# EAGLE design 4pwm (EAGLE 7.5.0)
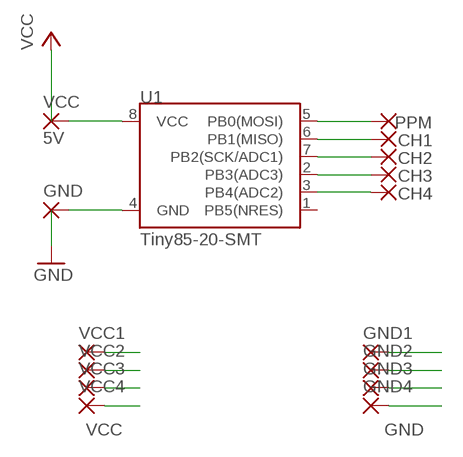
[diagram p0: schematic, sheet 1]

## Parts
CH1  SMD2  [SMD1,27-2,54]
CH2  SMD2  [SMD1,27-2,54]
CH3  SMD2  [SMD1,27-2,54]
CH4  SMD2  [SMD1,27-2,54]
GND  SMD2  [SMD1,27-2,54]
GND1  SMD2  [SMD1,27-2,54]
GND2  SMD2  [SMD1,27-2,54]
GND3  SMD2  [SMD1,27-2,54]
GND4  SMD2  [SMD1,27-2,54]
PPM  SMD2  [SMD1,27-2,54]
U1  Tiny85-20-SMT  ATTINY45TINY85-20-SMT  [SO08-EIAJ]
VCC  5V  SMD2  [SMD1,27-2,54]
VCC1  SMD2  [SMD1,27-2,54]
VCC2  SMD2  [SMD1,27-2,54]
VCC3  SMD2  [SMD1,27-2,54]
VCC4  SMD2  [SMD1,27-2,54]

## Nets
GND: GND1.1(P) GND2.1(P) GND3.1(P) GND4.1(P) GND.1(P) U1.4(GND)
N$3: PPM.1(P) U1.5(PB0(MOSI))
N$4: CH1.1(P) U1.6(PB1(MISO))
N$5: CH2.1(P) U1.7(PB2(SCK/ADC1))
N$6: CH3.1(P) U1.2(PB3(ADC3))
N$7: CH4.1(P) U1.3(PB4(ADC2))
VCC: U1.8(VCC) VCC1.1(P) VCC2.1(P) VCC3.1(P) VCC4.1(P) VCC.1(P)
Unconnected: U1.1(PB5(NRES))

## Library data of the parts
CH1-CH4 GND GND1-GND4 PPM VCC VCC1-VCC4 = wirepad:SMD2: SMD PAD
U1 = SparkFun-DigitalIC:ATTINY45: Atmel 8-pin 2/4/8kB flash uC; PROD_ID: IC-09092

## Board
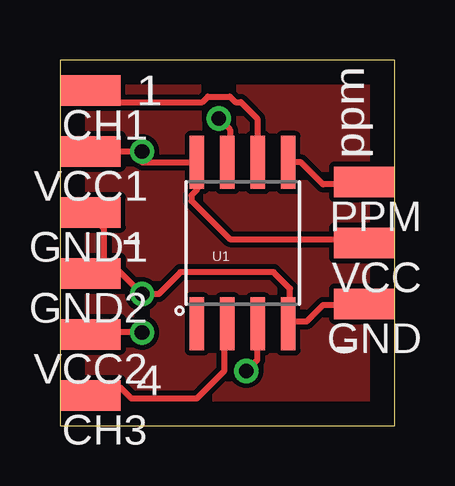
[diagram p1: board, top side]
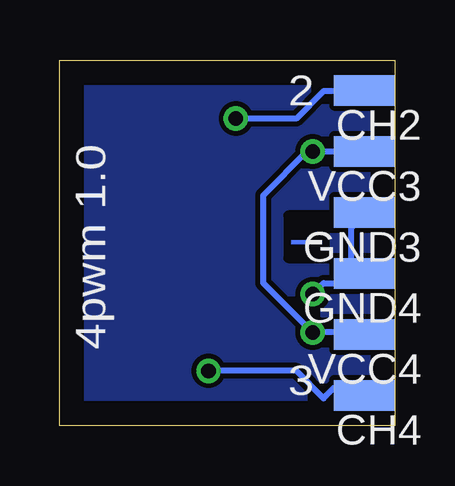
[diagram p2: board, bottom side, seen from below]

Size 13.97 x 15.24 mm. Coordinates in mm from the lower left corner, seen from the top.
Outline: 0,0 13.97,0 13.97,15.24 0,15.24 0,0
Copper layers (1*16): Top 0.035mm / dielectric 1.5mm / Bottom 0.035mm
Design rules "default": minimum track width 10mil, minimum drill 24mil, track to track 8mil, track to pad 8mil, pad to pad 8mil, via to via 8mil, smd to smd 8mil, copper to edge 40mil, drill to drill 8mil, minimum pad ring 10mil, minimum via ring 8mil, stop-mask expansion 4mil, vias tented up to drill 0mil, thermal gap 10mil

### Footprints (pad centres in the part's own frame; a part is rotated, then mirrored left to right if it is on the bottom)
SMD1,27-2,54 = smd 1.27 x 2.54: 1 0,0
SO08-EIAJ = smd 0.61 x 2.21: 1 -1.905,-3.378; 2 -0.635,-3.378; 3 0.635,-3.378; 4 1.905,-3.378; 5 1.905,3.353; 6 0.635,3.353; 7 -0.635,3.353; 8 -1.905,3.353

### Placement (x,y rotation side)
CH1  1.27,13.97 90 top
CH2  1.27,13.97 90 bottom
CH3  1.27,1.27 90 top
CH4  1.27,1.27 90 bottom
GND  12.7,5.08 90 top
GND1  1.27,8.89 90 top
GND2  1.27,6.35 90 top
GND3  1.27,8.89 90 bottom
GND4  1.27,6.35 90 bottom
PPM  12.7,10.16 90 top
U1  7.62,7.62 0 top
VCC  12.7,7.62 90 top
VCC1  1.27,11.43 90 top
VCC2  1.27,3.81 90 top
VCC3  1.27,11.43 90 bottom
VCC4  1.27,3.81 90 bottom

### Tracks (layer width: path | path; a pad name or v marks a point on that pad's centre or on a via)
GND  (via drill 0.61)
  Top 0.254: 1.6,6.63 1.83,6.86 1.83,8.23 1.37,8.69 GND3.1 | 1.6,6.63 1.37,6.4 GND4.1 1.6,6.63 | 1.6,6.63 2.29,6.63 v3.43,5.49 4.12,5.49 5.03,6.4 8.91,6.4 9.6,5.71 9.6,4.34 | 9.6,4.34 10.29,4.34 10.97,5.03 12.57,5.03 GND.1 | 9.6,4.34 U1.4
  Bottom 0.254: GND3.1 1.37,8.69 1.83,8.23 1.83,6.86 1.37,6.4 GND4.1 1.37,6.17 1.83,6.17 2.06,5.94 2.97,5.94 v3.43,5.49
N$2
  pour Bottom: 0,15.24 13.97,15.24 13.97,0 0,0
N$3
  Top 0.254: U1.5 10.06,10.97 10.97,10.06 12.57,10.06 PPM.1
N$4
  Top 0.254: U1.6 8.23,10.97 8.23,12.8 7.54,13.49 7.32,13.49 7.09,13.72 6.17,13.72 5.94,13.49 1.83,13.49 1.37,13.95 CH1.1
N$5  (via drill 0.61)
  Top 0.254: v6.63,12.8 7.09,12.34 7.09,10.97 U1.7
  Bottom 0.254: v6.63,12.8 4.12,12.8 2.97,13.95 1.37,13.95 CH2.1
N$6
  Top 0.254: CH3.1 1.6,1.6 2.52,1.6 2.97,1.14 5.71,1.14 6.86,2.29 6.86,4.12 U1.2
N$7  (via drill 0.61)
  Top 0.254: v7.77,2.29 8.23,2.74 8.23,4.12 U1.3
  Bottom 0.254: v7.77,2.29 4.12,2.29 2.97,1.14 2.52,1.6 1.6,1.6 CH4.1
N$8
  pour Top: 0,15.24 13.97,15.24 13.97,0 0,0
VCC  (via drill 0.61)
  Top 0.254: v3.43,3.89 1.37,3.89 VCC4.1 | 3.2,11.2 2.97,11.43 VCC3.1 | 3.2,11.2 3.43,10.97 U1.8 5.71,9.83 5.49,9.6 5.49,9.37 7.09,7.77 12.57,7.77 VCC.1 | 3.2,11.2 v3.43,11.43
  Bottom 0.254: VCC4.1 1.37,3.89 v3.43,3.89 5.49,5.94 5.49,9.6 3.66,11.43 v3.43,11.43 VCC3.1

### Text on the board
Bottom: -
tPlace: ppm | 1 | - | - | 4
bPlace: 2 | - | 4pwm 1.0 | 3